# Altium schematic sheet UniversalBoard.SchDoc: STM32F4 Headers
size A4; Author: Andrew Pobrica; DrawnBy: Andrew Pobrica; DocumentNumber: 1; SheetNumber: 1; SheetTotal: 7
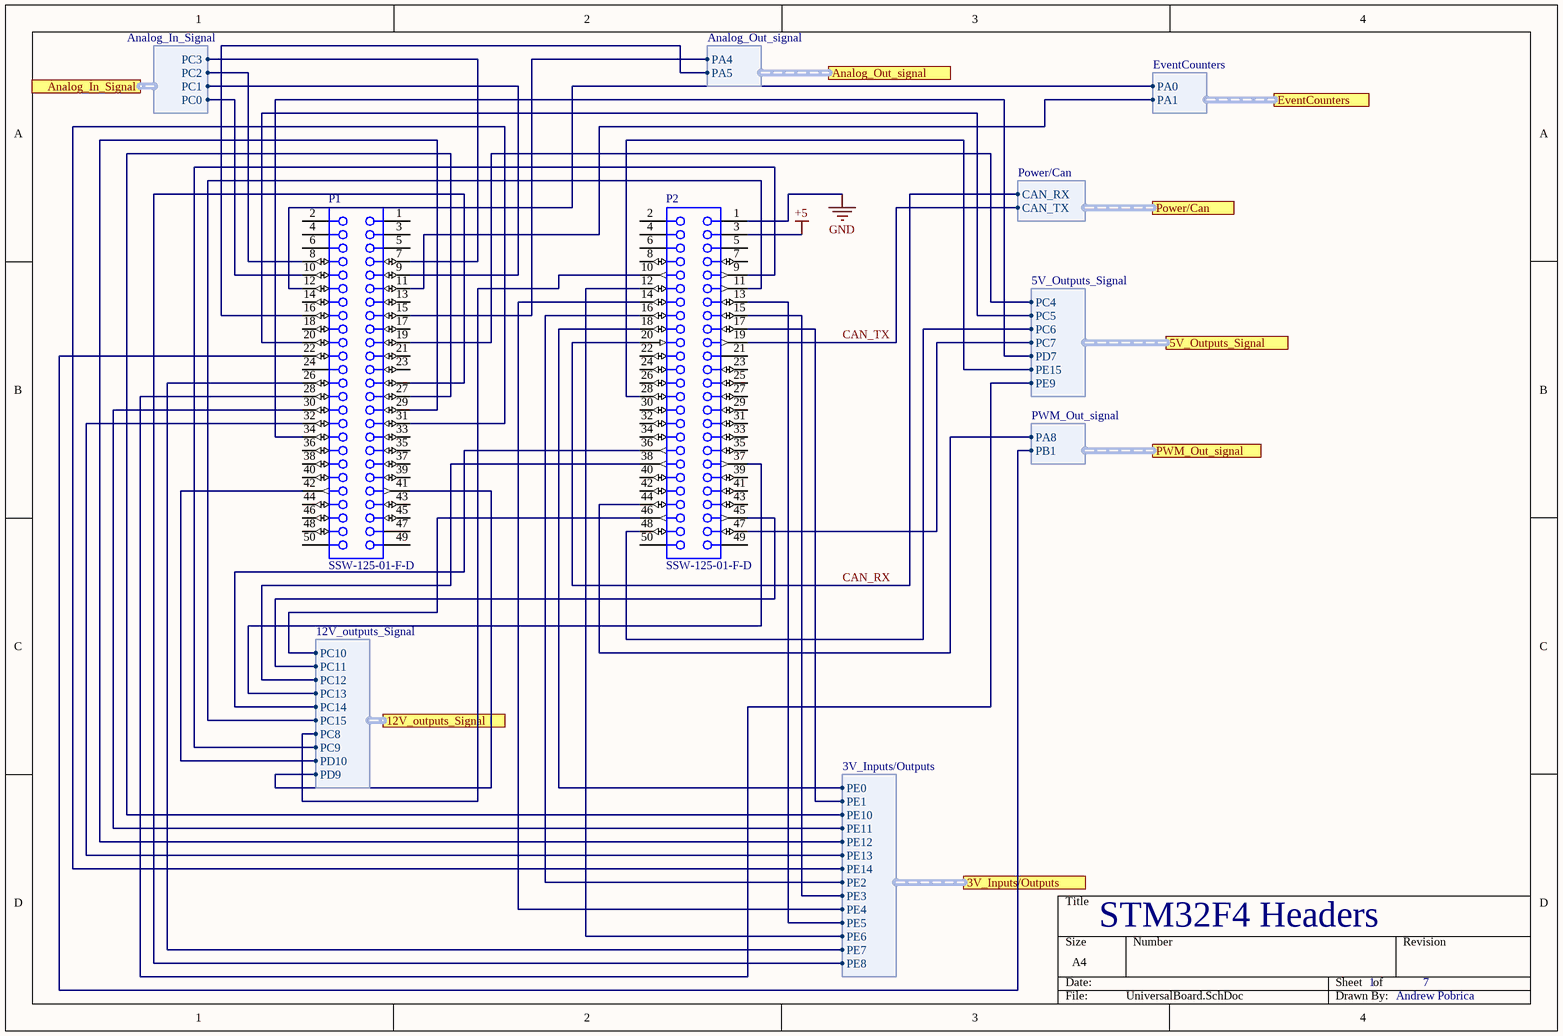
[diagram p0: UniversalBoard.SchDoc]

## Parts
P1  SSW-125-01-F-D  [SMTC-SSW-125-01-X-D]
P2  SSW-125-01-F-D  [SMTC-SSW-125-01-X-D]

## Ports
3V_Inputs/Outputs (harness 3V_Inputs/Outputs), 5V_Outputs_Signal (harness 5V_Outputs_Signal), 12V_outputs_Signal (harness 12V_outputs_Signal), Analog_In_Signal (harness Analog_In_Signal), Analog_Out_signal (harness Analog_Out_signal), EventCounters (harness EventCounters), Power/Can (harness Power/Can), PWM_Out_signal (harness PWM_Out_signal)

## Harnesses
Power/Can: CAN_RX, CAN_TX
PWM_Out_signal: PA8, PB1
5V_Outputs_Signal: PC4, PC5, PC6, PC7, PD7, PE15, PE9
Analog_In_Signal: PC0, PC1, PC2, PC3
12V_outputs_Signal: PC10, PC11, PC12, PC13, PC14, PC15, PC8, PC9, PD10, PD9
Analog_Out_signal: PA4, PA5
3V_Inputs/Outputs: PE0, PE1, PE10, PE11, PE12, PE13, PE14, PE2, PE3, PE4, PE5, PE6, PE7, PE8
EventCounters: PA0, PA1

## Nets
+5: P2.3(5V)
GND: P2.1(GND)
CAN_RX: P2.20(PB8) ; port Power/Can.CAN_RX
CAN_TX: P2.19(PB9) ; port Power/Can.CAN_TX
NetP1_7: P1.7(PC0) ; port Analog_In_Signal.PC3
NetP1_8: P1.8(PC1) ; port Analog_In_Signal.PC2
NetP1_9: P1.9(PC2) ; port Analog_In_Signal.PC1
NetP1_10: P1.10(PC3) ; port Analog_In_Signal.PC0
NetP1_11: P1.11(PA0) ; port EventCounters.PA1
NetP1_12: P1.12(PA1) ; port EventCounters.PA0
NetP1_15: P1.15(PA4) ; port Analog_Out_signal.PA4
NetP1_16: P1.16(PA5) ; port Analog_Out_signal.PA5
NetP1_19: P1.19(PC4) ; port 5V_Outputs_Signal.PC4
NetP1_20: P1.20(PC5) ; port 5V_Outputs_Signal.PC5
NetP1_22: P1.22(PB1) ; port PWM_Out_signal.PB1
NetP1_25: P1.25(PE8) ; port 3V_Inputs/Outputs.PE8
NetP1_26: P1.26(PE7) ; port 3V_Inputs/Outputs.PE7
NetP1_27: P1.27(PE10) ; port 3V_Inputs/Outputs.PE10
NetP1_28: P1.28(PE9) ; port 5V_Outputs_Signal.PE9
NetP1_29: P1.29(PE12) ; port 3V_Inputs/Outputs.PE12
NetP1_30: P1.30(PE11) ; port 3V_Inputs/Outputs.PE11
NetP1_31: P1.31(PE14) ; port 3V_Inputs/Outputs.PE14
NetP1_32: P1.32(PE13) ; port 3V_Inputs/Outputs.PE13
NetP1_34: P1.34(PE15) ; port 5V_Outputs_Signal.PD7
NetP1_41: P1.41(PD10) ; port 12V_outputs_Signal.PD9
NetP1_42: P1.42(PD9) ; port 12V_outputs_Signal.PD10
NetP2_9: P2.9(PC15) ; port 12V_outputs_Signal.PC9
NetP2_10: P2.10(PC14) ; port 12V_outputs_Signal.PC8
NetP2_11: P2.11(PC13) ; port 12V_outputs_Signal.PC15
NetP2_12: P2.12(PE6) ; port 3V_Inputs/Outputs.PE6
NetP2_13: P2.13(PE5) ; port 3V_Inputs/Outputs.PE5
NetP2_14: P2.14(PE4) ; port 3V_Inputs/Outputs.PE4
NetP2_15: P2.15(PE3) ; port 3V_Inputs/Outputs.PE3
NetP2_16: P2.16(PE2) ; port 3V_Inputs/Outputs.PE2
NetP2_17: P2.17(PE1) ; port 3V_Inputs/Outputs.PE1
NetP2_18: P2.18(PE0) ; port 3V_Inputs/Outputs.PE0
NetP2_28: P2.28(PD7) ; port 5V_Outputs_Signal.PE15
NetP2_36: P2.36(PC12) ; port 12V_outputs_Signal.PC14
NetP2_37: P2.37(PC11) ; port 12V_outputs_Signal.PC13
NetP2_38: P2.38(PC10) ; port 12V_outputs_Signal.PC12
NetP2_44: P2.44(PA8) ; port PWM_Out_signal.PA8
NetP2_45: P2.45(PC9) ; port 12V_outputs_Signal.PC11
NetP2_46: P2.46(PC8) ; port 12V_outputs_Signal.PC10
NetP2_47: P2.47(PC7) ; port 5V_Outputs_Signal.PC7
NetP2_48: P2.48(PC6) ; port 5V_Outputs_Signal.PC6

Not connected (* = marked no-connect by the designer): P1 1(GND) 2(GND) 3(VDD) 4(VDD) 5(NRST) 6(GND) 13(PA2) 14(PA3) 17(PA6) 18(PA7) 21(PB0) 23(PB2) 24(GND) 33(PB10) 35(PB12) 36(PB11) 37(PB14) 38(PB13) 39(PD8) 40(PB15) 43(PD12) 44(PD11) 45(PD14) 46(PD13) 47(NC) 48(PD15) 49(GND) 50(GND); P2 2(GND) 4(5V) 5(3V) 6(3V) 7(PH1) 8(PH0) 21(VDD) 22(BOOT0) 23(PB7) 24(PB6) 25(PB5) 26(PB4) 27(PB3) 29(PD6) 30(PD5) 31(PD4) 32(PD3) 33(PD2) 34(PD1) 35(PD0) 39(PA15) 40(PA14) 41(PA13) 42(PA10) 43(PA9) 49(GND) 50(GND)

## Library data of the parts
P1 P2 = CMP-1023-00476-1: SQ Post Socket, Through-hole, Vertical, -55 to 125 degC, 2.54 mm Pitch, 50-Pin, Female, RoHS; Manufacturer: Samtec; Pitch: 2.54 mm; PackageReference: SSW-125-01-X-D; RoHS: True; ComponentLink1Description: Manufacturer URL; Temperature Range: -55 to 125 degC; ComponentLink3URL: http://www.samtec.com/documents/webfiles/cpdf/SSW-1XX-XX-XXX-X-XX-XXX-XX-MKT.pdf; ComponentLink2URL: http://www.samtec.com/documents/webfiles/pdf/SSW_TH.PDF; PartNumber: SSW-125-01-F-D; PackageDescription: Assembly, Socket Strip .016 X .031 Tail; ComponentLink1URL: http://www.samtec.com; DatasheetVersion: F-214; PackageVersion: CA, 6/1987; ComponentLink2Description: Datasheet; Mounting Technology: Through-hole; Orientation: Vertical; ComponentLink3Description: Package Specification